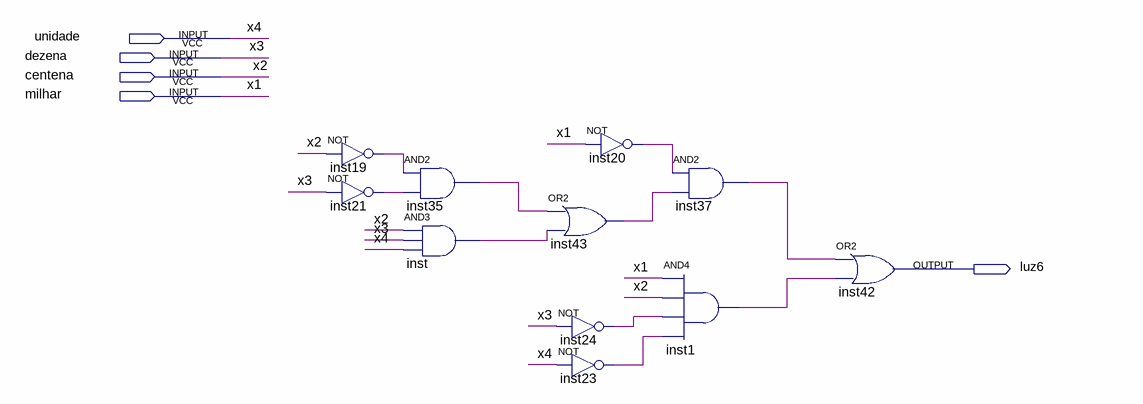
[diagram p0: schematic sheet]
// Quartus schematic luz6.bdf as structural Verilog: 11 symbols, 5 pins
module luz6 (
  input  unidade,
  input  dezena,
  input  centena,
  input  milhar,
  output luz6
);

  wire inst1_out, inst19_out, inst20_out, inst21_out, inst23_out, inst24_out, inst35_out, inst37_out,
       inst43_out, inst_out;

  not inst19 (inst19_out, centena);
  not inst21 (inst21_out, dezena);
  and inst35 (inst35_out, inst19_out, inst21_out);
  and inst (inst_out, centena, dezena, unidade);
  or inst43 (inst43_out, inst35_out, inst_out);
  not inst20 (inst20_out, milhar);
  not inst24 (inst24_out, dezena);
  not inst23 (inst23_out, unidade);
  and inst37 (inst37_out, inst20_out, inst43_out);
  and inst1 (inst1_out, milhar, centena, inst24_out, inst23_out);
  or inst42 (luz6, inst37_out, inst1_out);

  // Other names for the same wires on the sheet: x1 = milhar; x2 = centena; x3 = dezena; x4 = unidade
endmodule
